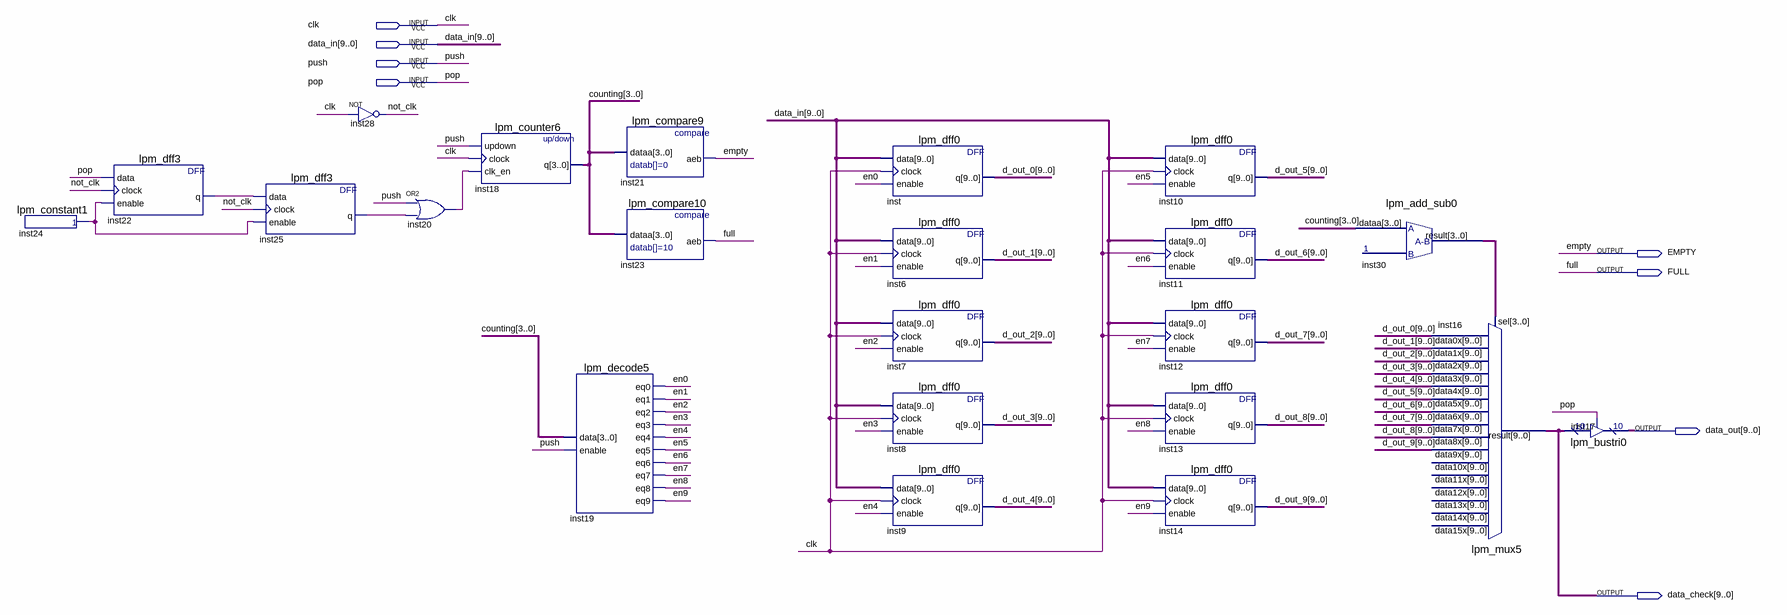
[diagram p0: schematic sheet]
// Quartus schematic STEAK.bdf as structural Verilog: 22 symbols, 8 pins
module STEAK (
  input  clk,
  input  [9:0] data_in,
  input  push,
  input  pop,
  output EMPTY,
  output FULL,
  output [9:0] data_out,
  output [9:0] data_check
);

  wire en0, en1, en2, en3, en4, en5, en6, en7, en8, en9, inst20_out, inst22_q, inst24_result, inst25_q,
       not_clk;
  wire [3:0] counting, inst30_result;
  wire [9:0] d_out_0, d_out_1, d_out_2, d_out_3, d_out_4, d_out_5, d_out_6, d_out_7, d_out_8, d_out_9;

  lpm_constant1 inst24 (.result(inst24_result));
  lpm_dff3 inst22 (.data(pop), .clock(not_clk), .enable(inst24_result), .q(inst22_q));
  lpm_dff3 inst25 (.data(inst22_q), .clock(not_clk), .enable(inst24_result), .q(inst25_q));
  not inst28 (not_clk, clk);
  or inst20 (inst20_out, push, inst25_q);
  lpm_counter6 inst18 (.updown(push), .clock(clk), .clk_en(inst20_out), .q(counting));
  lpm_decode5 inst19 (
    .data(counting), .enable(push), .eq0(en0), .eq1(en1), .eq2(en2), .eq3(en3), .eq4(en4), .eq5(en5),
    .eq6(en6), .eq7(en7), .eq8(en8), .eq9(en9));
  lpm_compare9 inst21 (.dataa(counting), .aeb(EMPTY));
  lpm_compare10 inst23 (.dataa(counting), .aeb(FULL));
  lpm_dff0 inst (.data(data_in), .clock(clk), .enable(en0), .q(d_out_0));
  lpm_dff0 inst6 (.data(data_in), .clock(clk), .enable(en1), .q(d_out_1));
  lpm_dff0 inst7 (.data(data_in), .clock(clk), .enable(en2), .q(d_out_2));
  lpm_dff0 inst8 (.data(data_in), .clock(clk), .enable(en3), .q(d_out_3));
  lpm_dff0 inst9 (.data(data_in), .clock(clk), .enable(en4), .q(d_out_4));
  lpm_dff0 inst10 (.data(data_in), .clock(clk), .enable(en5), .q(d_out_5));
  lpm_dff0 inst11 (.data(data_in), .clock(clk), .enable(en6), .q(d_out_6));
  lpm_dff0 inst12 (.data(data_in), .clock(clk), .enable(en7), .q(d_out_7));
  lpm_dff0 inst13 (.data(data_in), .clock(clk), .enable(en8), .q(d_out_8));
  lpm_dff0 inst14 (.data(data_in), .clock(clk), .enable(en9), .q(d_out_9));
  lpm_add_sub0 inst30 (.dataa(counting), .result(inst30_result));
  lpm_mux5 inst16 (
    .data9x(d_out_9), .data8x(d_out_8), .data7x(d_out_7), .data6x(d_out_6), .data5x(d_out_5),
    .data4x(d_out_4), .data3x(d_out_3), .data2x(d_out_2), .data1x(d_out_1), .data0x(d_out_0),
    .sel(inst30_result), .result(data_check));  // open: data15x, data14x, data13x, data12x, data11x, data10x
  lpm_bustri0 inst17 (.enabledt(pop), .data(data_check), .tridata(data_out));
endmodule
